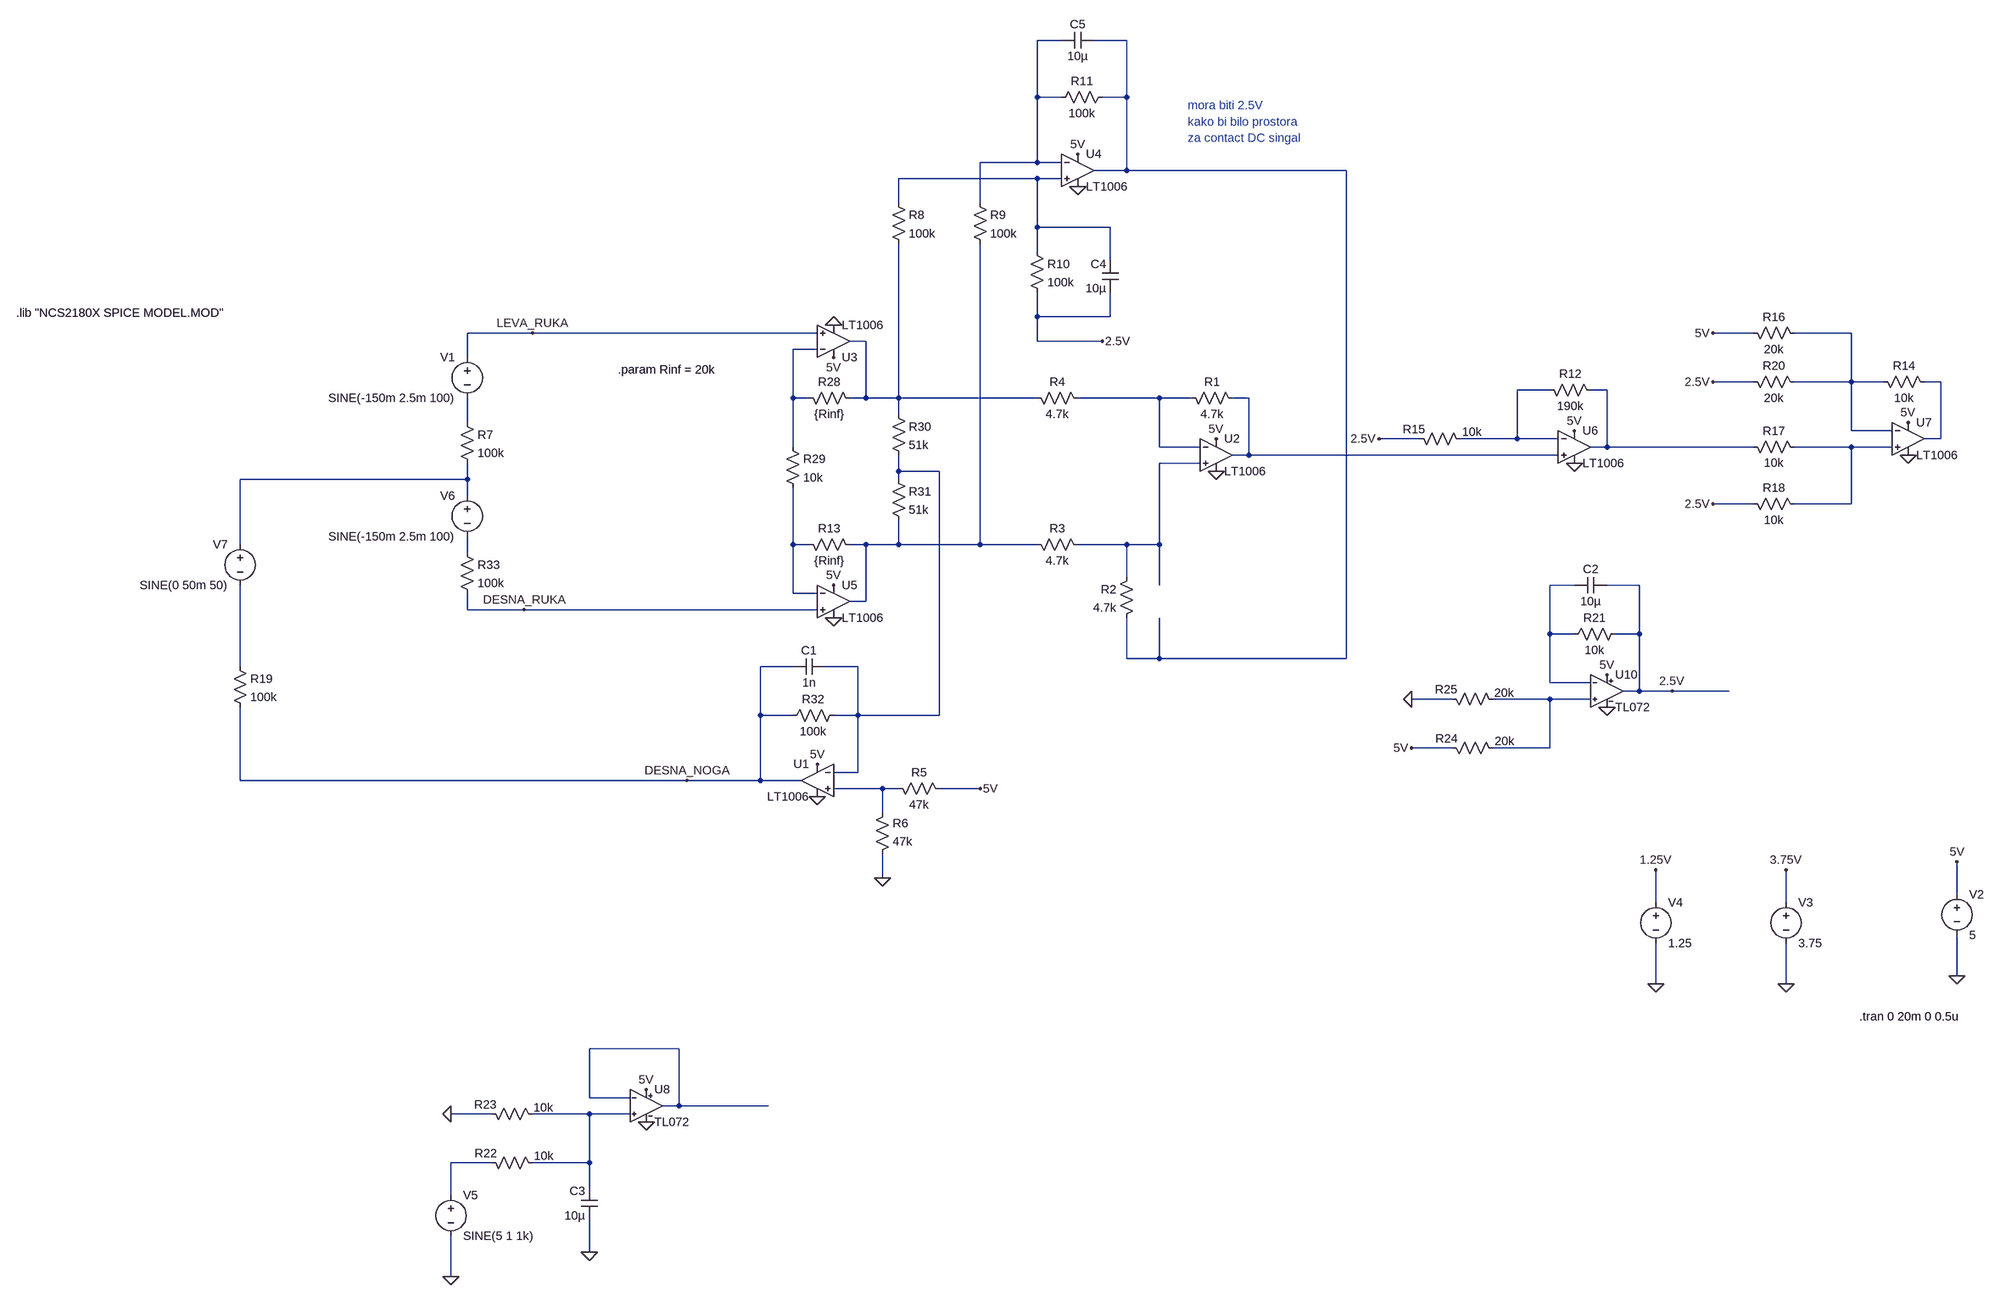
[diagram p0: schematic NCS_v2.asc]
NCS_v2.asc, the LTspice schematic file:
Version 4
SHEET 1 2656 1716
WIRE 0 -736 -48 -736
WIRE 128 -736 64 -736
WIRE -48 -624 -48 -736
WIRE 0 -624 -48 -624
WIRE 128 -624 128 -736
WIRE 128 -624 80 -624
WIRE -48 -496 -48 -624
WIRE -48 -496 -160 -496
WIRE 0 -496 -48 -496
WIRE 128 -480 128 -624
WIRE 128 -480 64 -480
WIRE 560 -480 128 -480
WIRE -48 -464 -320 -464
WIRE 0 -464 -48 -464
WIRE -320 -416 -320 -464
WIRE -160 -416 -160 -496
WIRE -48 -368 -48 -464
WIRE 96 -368 -48 -368
WIRE -48 -320 -48 -368
WIRE 96 -304 96 -368
WIRE -48 -192 -48 -240
WIRE 96 -192 96 -240
WIRE 96 -192 -48 -192
WIRE -1040 -160 -1168 -160
WIRE -480 -160 -1040 -160
WIRE 1360 -160 1280 -160
WIRE 1552 -160 1440 -160
WIRE -384 -144 -416 -144
WIRE -48 -144 -48 -192
WIRE 80 -144 -48 -144
WIRE -480 -128 -528 -128
WIRE -1168 -112 -1168 -160
WIRE 1360 -64 1280 -64
WIRE 1552 -64 1552 -160
WIRE 1552 -64 1440 -64
WIRE 1616 -64 1552 -64
WIRE 1728 -64 1696 -64
WIRE 960 -48 896 -48
WIRE 1072 -48 1040 -48
WIRE -528 -32 -528 -128
WIRE -496 -32 -528 -32
WIRE -384 -32 -384 -144
WIRE -384 -32 -416 -32
WIRE -320 -32 -320 -336
WIRE -320 -32 -384 -32
WIRE -48 -32 -320 -32
WIRE 192 -32 32 -32
WIRE 256 -32 192 -32
WIRE 368 -32 336 -32
WIRE -320 0 -320 -32
WIRE -1168 16 -1168 -32
WIRE 1552 32 1552 -64
WIRE 1632 32 1552 32
WIRE 704 48 624 48
WIRE 896 48 896 -48
WIRE 896 48 784 48
WIRE 976 48 896 48
WIRE 1728 48 1728 -64
WIRE 1728 48 1696 48
WIRE -528 64 -528 -32
WIRE 192 64 192 -32
WIRE 272 64 192 64
WIRE 1072 64 1072 -48
WIRE 1072 64 1040 64
WIRE 1360 64 1072 64
WIRE 1552 64 1440 64
WIRE 1632 64 1552 64
WIRE 368 80 368 -32
WIRE 368 80 336 80
WIRE 976 80 368 80
WIRE 272 96 192 96
WIRE -320 112 -320 80
WIRE -240 112 -320 112
WIRE -1168 128 -1168 96
WIRE -1168 128 -1616 128
WIRE -320 128 -320 112
WIRE -1168 160 -1168 128
WIRE 1360 176 1280 176
WIRE 1552 176 1552 64
WIRE 1552 176 1440 176
WIRE -1616 256 -1616 128
WIRE -528 256 -528 144
WIRE -496 256 -528 256
WIRE -384 256 -416 256
WIRE -320 256 -320 208
WIRE -320 256 -384 256
WIRE -160 256 -160 -336
WIRE -160 256 -320 256
WIRE -48 256 -160 256
WIRE 128 256 32 256
WIRE 192 256 192 96
WIRE 192 256 128 256
WIRE -1168 272 -1168 240
WIRE 128 320 128 256
WIRE 192 336 192 256
WIRE 1008 336 960 336
WIRE 1136 336 1072 336
WIRE -528 352 -528 256
WIRE -480 352 -528 352
WIRE -384 368 -384 256
WIRE -384 368 -416 368
WIRE -1168 384 -1168 352
WIRE -1056 384 -1168 384
WIRE -480 384 -1056 384
WIRE 960 432 960 336
WIRE 1008 432 960 432
WIRE 1136 432 1136 336
WIRE 1136 432 1088 432
WIRE 128 480 128 400
WIRE 192 480 192 400
WIRE 192 480 128 480
WIRE 560 480 560 -480
WIRE 560 480 192 480
WIRE -1616 496 -1616 336
WIRE -528 496 -592 496
WIRE -400 496 -464 496
WIRE 960 528 960 432
WIRE 1040 528 960 528
WIRE 1136 544 1136 432
WIRE 1136 544 1104 544
WIRE 1200 544 1136 544
WIRE 1312 544 1200 544
WIRE 768 560 688 560
WIRE 960 560 848 560
WIRE 1040 560 960 560
WIRE -592 592 -592 496
WIRE -528 592 -592 592
WIRE -400 592 -400 496
WIRE -400 592 -448 592
WIRE -240 592 -240 112
WIRE -240 592 -400 592
WIRE 768 656 688 656
WIRE 960 656 960 560
WIRE 960 656 848 656
WIRE -400 704 -400 592
WIRE -400 704 -448 704
WIRE -1616 720 -1616 576
WIRE -736 720 -1616 720
WIRE -592 720 -592 592
WIRE -592 720 -736 720
WIRE -512 720 -592 720
WIRE -352 736 -448 736
WIRE -320 736 -352 736
WIRE -160 736 -240 736
WIRE -352 784 -352 736
WIRE -352 912 -352 864
WIRE 1760 944 1760 880
WIRE 1168 960 1168 896
WIRE 1424 960 1424 896
WIRE 1760 1104 1760 1024
WIRE 1168 1120 1168 1040
WIRE 1424 1120 1424 1040
WIRE -752 1248 -928 1248
WIRE -928 1344 -928 1248
WIRE -848 1344 -928 1344
WIRE -752 1360 -752 1248
WIRE -752 1360 -784 1360
WIRE -576 1360 -752 1360
WIRE -1120 1376 -1200 1376
WIRE -928 1376 -1040 1376
WIRE -848 1376 -928 1376
WIRE -1120 1472 -1200 1472
WIRE -928 1472 -928 1376
WIRE -928 1472 -1040 1472
WIRE -928 1520 -928 1472
WIRE -1200 1536 -1200 1472
WIRE -928 1648 -928 1584
WIRE -1200 1696 -1200 1616
FLAG -448 -176 0
FLAG -448 400 0
FLAG 1760 1104 0
FLAG 1760 880 5V
FLAG 304 112 0
FLAG -480 752 0
FLAG -352 912 0
FLAG -736 720 DESNA_NOGA
FLAG -1040 -160 LEVA_RUKA
FLAG -1056 384 DESNA_RUKA
FLAG -480 688 5V
FLAG -448 336 5V
FLAG 304 48 5V
FLAG -448 -112 5V
FLAG -160 736 5V
FLAG 32 -448 0
FLAG 32 -512 5V
FLAG 80 -144 2.5V
FLAG 1008 96 0
FLAG 1008 32 5V
FLAG 1664 80 0
FLAG 1664 16 5V
FLAG 1424 1120 0
FLAG 1424 896 3.75V
FLAG 1168 1120 0
FLAG 1168 896 1.25V
FLAG 1280 -160 5V
FLAG 1280 176 2.5V
FLAG 624 48 2.5V
FLAG 1072 576 0
FLAG 1072 512 5V
FLAG 688 656 5V
FLAG 688 560 0
FLAG 1200 544 2.5V
FLAG 1280 -64 2.5V
FLAG -816 1392 0
FLAG -816 1328 5V
FLAG -1200 1376 0
FLAG -1200 1696 0
FLAG -928 1648 0
SYMBOL voltage -1168 -128 M0
WINDOW 123 0 0 Left 0
WINDOW 39 0 0 Left 0
SYMATTR InstName V1
SYMATTR Value SINE(-150m 2.5m 100)
SYMBOL voltage 1760 928 R0
WINDOW 123 0 0 Left 0
WINDOW 39 0 0 Left 0
SYMATTR InstName V2
SYMATTR Value 5
SYMBOL res 240 -48 M90
WINDOW 0 0 56 VBottom 2
WINDOW 3 32 56 VTop 2
SYMATTR InstName R1
SYMATTR Value 4.7k
SYMBOL res 144 304 M0
SYMATTR InstName R2
SYMATTR Value 4.7k
SYMBOL res 48 272 M270
WINDOW 0 32 56 VTop 2
WINDOW 3 0 56 VBottom 2
SYMATTR InstName R3
SYMATTR Value 4.7k
SYMBOL res 48 -16 M270
WINDOW 0 32 56 VTop 2
WINDOW 3 0 56 VBottom 2
SYMATTR InstName R4
SYMATTR Value 4.7k
SYMBOL res -224 752 M270
WINDOW 0 32 56 VTop 2
WINDOW 3 0 56 VBottom 2
SYMATTR InstName R5
SYMATTR Value 47k
SYMBOL res -368 880 M180
WINDOW 0 36 76 Left 2
WINDOW 3 36 40 Left 2
SYMATTR InstName R6
SYMATTR Value 47k
SYMBOL res -1184 0 R0
SYMATTR InstName R7
SYMATTR Value 100k
SYMBOL res -1632 480 R0
SYMATTR InstName R19
SYMATTR Value 100k
SYMBOL res -400 -16 M270
WINDOW 0 32 56 VTop 2
WINDOW 3 0 56 VBottom 2
SYMATTR InstName R28
SYMATTR Value {Rinf}
SYMBOL res -544 48 R0
SYMATTR InstName R29
SYMATTR Value 10k
SYMBOL res -336 -16 R0
SYMATTR InstName R30
SYMATTR Value 51k
SYMBOL res -336 112 R0
SYMATTR InstName R31
SYMATTR Value 51k
SYMBOL res -432 576 R90
WINDOW 0 0 56 VBottom 2
WINDOW 3 32 56 VTop 2
SYMATTR InstName R32
SYMATTR Value 100k
SYMBOL voltage -1168 144 M0
WINDOW 123 0 0 Left 0
WINDOW 39 0 0 Left 0
SYMATTR InstName V6
SYMATTR Value SINE(-150m 2.5m 100)
SYMBOL res -1184 256 R0
SYMATTR InstName R33
SYMATTR Value 100k
SYMBOL voltage -1616 240 M0
WINDOW 123 0 0 Left 0
WINDOW 39 0 0 Left 0
SYMATTR InstName V7
SYMATTR Value SINE(0 50m 50)
SYMBOL cap -464 480 R90
WINDOW 0 0 32 VBottom 2
WINDOW 3 32 32 VTop 2
SYMATTR InstName C1
SYMATTR Value 1n
SYMBOL OpAmps\\LT1006 -448 304 R0
SYMATTR InstName U5
SYMBOL OpAmps\\LT1006 -480 656 M0
SYMATTR InstName U1
SYMBOL OpAmps\\LT1006 304 16 R0
SYMATTR InstName U2
SYMBOL OpAmps\\LT1006 -448 -80 M180
SYMATTR InstName U3
SYMBOL OpAmps\\LT1006 32 -544 R0
SYMATTR InstName U4
SYMBOL res -336 -432 R0
SYMATTR InstName R8
SYMATTR Value 100k
SYMBOL res -176 -432 R0
SYMATTR InstName R9
SYMATTR Value 100k
SYMBOL res -64 -336 R0
SYMATTR InstName R10
SYMATTR Value 100k
SYMBOL res 96 -640 R90
WINDOW 0 0 56 VBottom 2
WINDOW 3 32 56 VTop 2
SYMATTR InstName R11
SYMATTR Value 100k
SYMBOL cap 112 -240 R180
WINDOW 0 24 56 Left 2
WINDOW 3 24 8 Left 2
SYMATTR InstName C4
SYMATTR Value 10µ
SYMBOL cap 0 -720 R270
WINDOW 0 32 32 VTop 2
WINDOW 3 0 32 VBottom 2
SYMATTR InstName C5
SYMATTR Value 10µ
SYMBOL res 944 -64 M90
WINDOW 0 0 56 VBottom 2
WINDOW 3 32 56 VTop 2
SYMATTR InstName R12
SYMATTR Value 190k
SYMBOL OpAmps\\LT1006 1008 0 R0
SYMATTR InstName U6
SYMBOL res -400 272 M270
WINDOW 0 32 56 VTop 2
WINDOW 3 0 56 VBottom 2
SYMATTR InstName R13
SYMATTR Value {Rinf}
SYMBOL res 1600 -80 M90
WINDOW 0 0 56 VBottom 2
WINDOW 3 32 56 VTop 2
SYMATTR InstName R14
SYMATTR Value 10k
SYMBOL OpAmps\\LT1006 1664 -16 R0
SYMATTR InstName U7
SYMBOL voltage 1424 944 R0
WINDOW 123 0 0 Left 0
WINDOW 39 0 0 Left 0
SYMATTR InstName V3
SYMATTR Value 3.75
SYMBOL res 1456 80 M270
WINDOW 0 32 56 VTop 2
WINDOW 3 0 56 VBottom 2
SYMATTR InstName R17
SYMATTR Value 10k
SYMBOL res 1344 160 M90
WINDOW 0 0 56 VBottom 2
WINDOW 3 32 56 VTop 2
SYMATTR InstName R18
SYMATTR Value 10k
SYMBOL voltage 1168 944 R0
WINDOW 123 0 0 Left 0
WINDOW 39 0 0 Left 0
SYMATTR InstName V4
SYMATTR Value 1.25
SYMBOL res 688 32 M90
WINDOW 0 13 5 VBottom 2
WINDOW 3 -13 119 VTop 2
SYMATTR InstName R15
SYMATTR Value 10k
SYMBOL res 752 640 M90
WINDOW 0 13 5 VBottom 2
WINDOW 3 -13 119 VTop 2
SYMATTR InstName R24
SYMATTR Value 20k
SYMBOL res 752 544 M90
WINDOW 0 13 4 VBottom 2
WINDOW 3 -12 118 VTop 2
SYMATTR InstName R25
SYMATTR Value 20k
SYMBOL res 1344 -176 M90
WINDOW 0 0 56 VBottom 2
WINDOW 3 32 56 VTop 2
SYMATTR InstName R16
SYMATTR Value 20k
SYMBOL res 1344 -80 M90
WINDOW 0 0 56 VBottom 2
WINDOW 3 32 56 VTop 2
SYMATTR InstName R20
SYMATTR Value 20k
SYMBOL res 1104 416 R90
WINDOW 0 0 56 VBottom 2
WINDOW 3 32 56 VTop 2
SYMATTR InstName R21
SYMATTR Value 10k
SYMBOL cap 1072 320 R90
WINDOW 0 0 32 VBottom 2
WINDOW 3 32 32 VTop 2
SYMATTR InstName C2
SYMATTR Value 10µ
SYMBOL res -1136 1456 M90
WINDOW 0 13 5 VBottom 2
WINDOW 3 -13 119 VTop 2
SYMATTR InstName R22
SYMATTR Value 10k
SYMBOL res -1136 1360 M90
WINDOW 0 13 4 VBottom 2
WINDOW 3 -12 118 VTop 2
SYMATTR InstName R23
SYMATTR Value 10k
SYMBOL cap -912 1584 R180
WINDOW 0 24 56 Left 2
WINDOW 3 24 8 Left 2
SYMATTR InstName C3
SYMATTR Value 10µ
SYMBOL voltage -1200 1520 R0
WINDOW 123 0 0 Left 0
WINDOW 39 0 0 Left 0
SYMATTR InstName V5
SYMATTR Value SINE(5 1 1k)
SYMBOL TL072 -816 1360 R0
SYMATTR InstName U8
SYMBOL TL072 1072 544 R0
SYMATTR InstName U10
TEXT 1568 1184 Left 2 !.tran 0 20m 0 0.5u
TEXT -2056 -200 Left 2 !.lib "NCS2180X SPICE MODEL.MOD"
TEXT -872 -88 Left 2 !.param Rinf = 20k
TEXT 248 -608 Left 2 ;mora biti 2.5V
TEXT 248 -576 Left 2 ;kako bi bilo prostora
TEXT 248 -544 Left 2 ;za contact DC singal

The netlist it stands for:
* NCS_v2.asc
V1 LEVA_RUKA N012 SINE(-150m 2.5m 100)
V2 5V 0 5
R1 N010 N011 4.7k
R2 N014 N002 4.7k
R3 N014 N018 4.7k
R4 N010 N005 4.7k
R5 5V N023 47k
R6 0 N023 47k
R7 N012 N016 100k
R19 N021 DESNA_NOGA 100k
R28 N005 N006 {Rinf}
R29 N006 N017 10k
R30 N005 N015 51k
R31 N015 N018 51k
R32 N015 DESNA_NOGA 100k
V6 N016 N019 SINE(-150m 2.5m 100)
R33 N019 DESNA_RUKA 100k
V7 N016 N021 SINE(0 50m 50)
C1 N015 DESNA_NOGA 1n
XU5 DESNA_RUKA N017 5V 0 N018 LT1006  ; pins In+ In- V+ V- OUT
XU1 N023 N015 5V 0 DESNA_NOGA LT1006  ; pins In+ In- V+ V- OUT
XU2 N014 N010 5V 0 N011 LT1006  ; pins In+ In- V+ V- OUT
XU3 LEVA_RUKA N006 5V 0 N005 LT1006  ; pins In+ In- V+ V- OUT
XU4 N003 N001 5V 0 N002 LT1006  ; pins In+ In- V+ V- OUT
R8 N003 N005 100k
R9 N001 N018 100k
R10 N003 2.5V 100k
R11 N002 N001 100k
C4 2.5V N003 10µ
C5 N001 N002 10µ
R12 N008 N009 190k
XU6 N011 N008 5V 0 N009 LT1006  ; pins In+ In- V+ V- OUT
R13 N018 N017 {Rinf}
R14 N004 N007 10k
XU7 N013 N004 5V 0 N007 LT1006  ; pins In+ In- V+ V- OUT
V3 3.75V 0 3.75
R17 N013 N009 10k
R18 2.5V N013 10k
V4 1.25V 0 1.25
R15 2.5V N008 10k
R24 5V N022 20k
R25 0 N022 20k
R16 5V N004 20k
R20 2.5V N004 20k
R21 2.5V N020 10k
C2 2.5V N020 10µ
R22 N026 N025 10k
R23 0 N025 10k
C3 0 N025 10µ
V5 N026 0 SINE(5 1 1k)
XU8 N025 N024 5V 0 N024 TL072  ; pins 1 2 3 4 5
XU10 N022 N020 5V 0 2.5V TL072  ; pins 1 2 3 4 5
.tran 0 20m 0 0.5u
.lib "NCS2180X SPICE MODEL.MOD"
.param Rinf = 20k
* mora biti 2.5V
* kako bi bilo prostora
* za contact DC singal
.lib LTC.lib
.lib TL072.cir
.backanno
.end